# Altium schematic sheet 5V_Digital_In.SchDoc
size B; DocumentNumber: 17; SheetNumber: 17; SheetTotal: 29
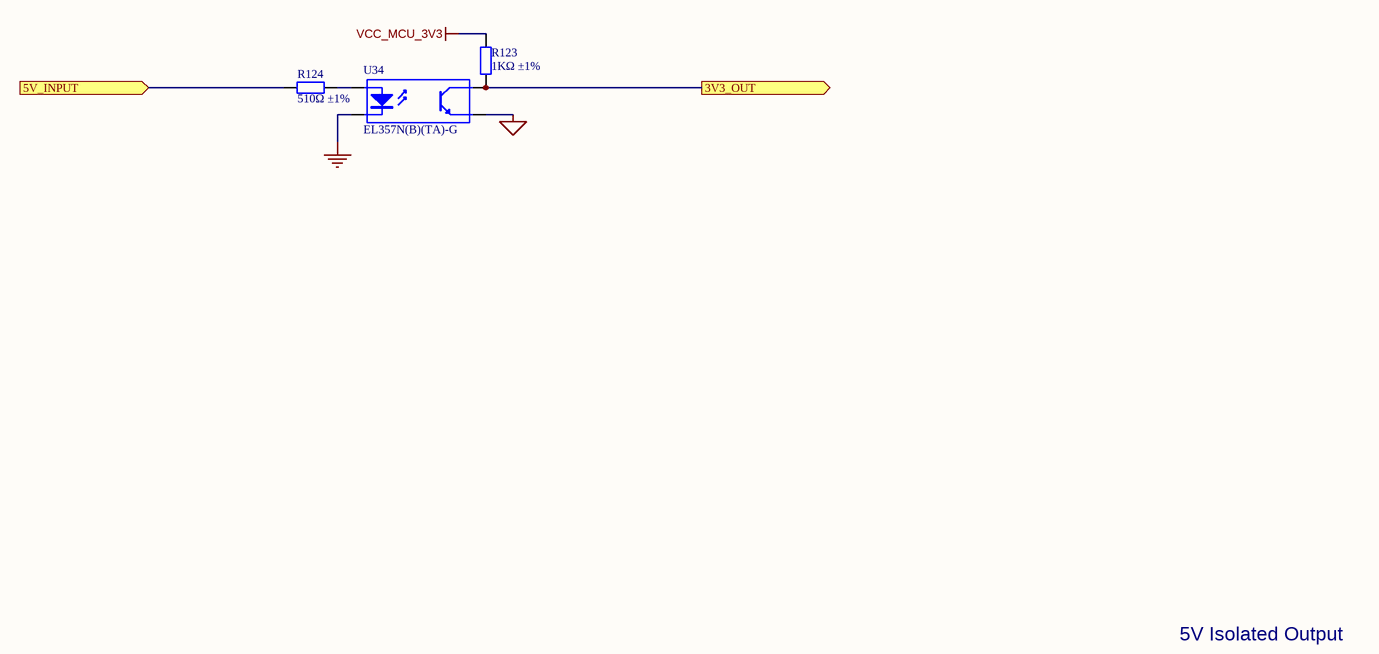
[diagram p0: 5V_Digital_In.SchDoc]

## Parts
R123  1KΩ ±1%  [0603_R]
R124  510Ω ±1%  [0603_R]
U34  EL357N(B)(TA)-G  [SOP-4_P2.54]

## Ports
3V3_OUT (out), 5V_INPUT (in)

## Nets
GND: U34.2(K)
MCU_GND: U34.3(E)
VCC_MCU_3V3: R123.1
3V3_OUT: R123.2 U34.4(C) ; port 3V3_OUT
5V_INPUT: R124.1 ; port 5V_INPUT
NetR124_2: R124.2 U34.1(A)

## Notes on the sheet
- 5V Isolated Output
- SHEET
- Expatria Technologies
- 1136 Glade Court
- Port Coquitlam, BC V3B 1R5
- PROJECT
- SIZE
- ENGR
- MODIFIED
- DOCUMENT
- REV
- Copyright Expatria Technologies 2022. This document describes Open Hardware and is licensed under the CERN-OHL-S v2. No warranty is implied or expressed.
- EMAIL: INFO@EXPATRIA.CA
- B
- /

## Library data of the parts
R123 = 0603 1K (1001) 1%: Chip resistor; Manufacturer: Uniroyal Elec; PartNumber: 0603WAF1001T5E; Power: 1/10W; Package: 0603; Supplier: LC; SuppliersPartNumber: C21190; Resistance: 1KΩ; Tolerance: 1%; ComponentLink1Description: Supplier link; ComponentLink1URL: http://www.szlcsc.com/product/details_21904.html
R124 = 0603 510R (5100) 1%: Chip resistor; Manufacturer: Uniroyal Elec; PartNumber: 0603WAF5100T5E; Power: 1/10W; ComponentLink1Description: Supplier link; ComponentLink1URL: http://www.szlcsc.com/product/details_23920.html; Package: 0603; Supplier: LC; SuppliersPartNumber: C23193; Resistance: 510Ω; Tolerance: 1%
U34 = EL357N(B)(TA)-G_[C6649]: OPTOISOLATOR 3.75KV TRANS 4-SOP; Manufacturer 1: Everlight Elec; ComponentLink1Description: 供应商链接; ComponentLink1URL: http://www.szlcsc.com/product/details_7114.html; Package: SOP-4_P2.54; Supplier: LC; SuppliersPartNumber: C6649; Manufacturer Part Number 1: EL357N(B)(TA)-G